# EAGLE design Sensores_2018 (EAGLE 8.5.1)
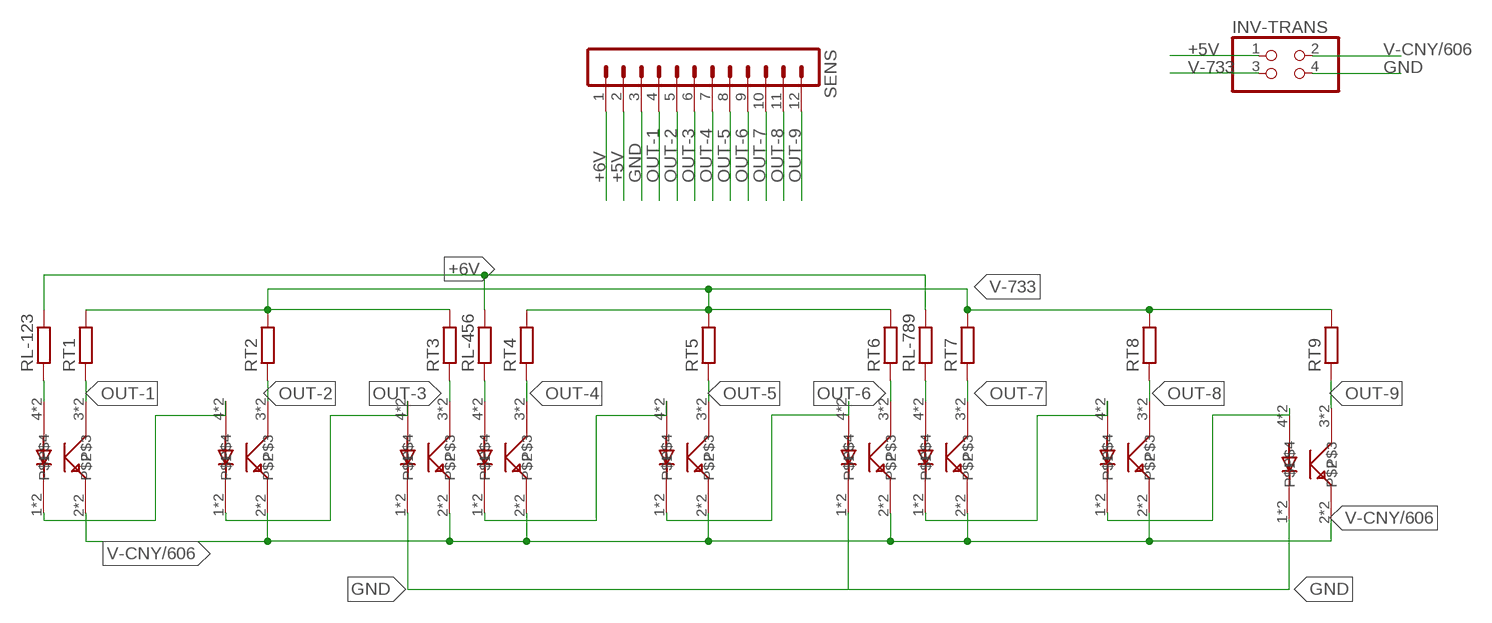
[diagram p0: schematic, sheet 1]

## Parts
INV-TRANS  PINHD-2X2  [2X02]
RL-123  R-EU_R0805W  [R0805W]
RL-456  R-EU_R0805W  [R0805W]
RL-789  R-EU_R0805W  [R0805W]
RT1  R-EU_R0805W  [R0805W]
RT2  R-EU_R0805W  [R0805W]
RT3  R-EU_R0805W  [R0805W]
RT4  R-EU_R0805W  [R0805W]
RT5  R-EU_R0805W  [R0805W]
RT6  R-EU_R0805W  [R0805W]
RT7  R-EU_R0805W  [R0805W]
RT8  R-EU_R0805W  [R0805W]
RT9  R-EU_R0805W  [R0805W]
S1  OPB733+OPB606+CNY70  [OPB733+606]
S2  OPB733+OPB606+CNY70  [OPB733+606]
S3  OPB733+OPB606+CNY70  [OPB733+606]
S4  OPB733+OPB606+CNY70  [OPB733+606]
S5  OPB733+OPB606+CNY70  [OPB733+606]
S6  OPB733+OPB606+CNY70  [OPB733+606]
S7  OPB733+OPB606+CNY70  [OPB733+606]
S8  OPB733+OPB606+CNY70  [OPB733+606]
S9  OPB733+OPB606+CNY70  [OPB733+606]
SENS  MA12-1  [MA12-1]

## Nets
+5V: INV-TRANS.1 SENS.2
+6V: RL-123.2 RL-456.2 RL-789.2 SENS.1
GND: INV-TRANS.4 S3.1 S3.P$1 S6.1 S6.P$1 S9.1 S9.P$1 SENS.3
N$1: RL-123.1 S1.4 S1.P$4
N$2: S1.1 S1.P$1 S2.4 S2.P$4
N$5: S2.1 S2.P$1 S3.4 S3.P$4
N$9: RL-456.1 S4.4 S4.P$4
N$11: S4.1 S4.P$1 S5.4 S5.P$4
N$14: S5.1 S5.P$1 S6.4 S6.P$4
N$18: RL-789.1 S7.4 S7.P$4
N$19: S7.1 S7.P$1 S8.4 S8.P$4
N$22: S8.1 S8.P$1 S9.4 S9.P$4
OUT-1: RT1.1 S1.3 S1.P$3 SENS.4
OUT-2: RT2.1 S2.3 S2.P$3 SENS.5
OUT-3: RT3.1 S3.3 S3.P$3 SENS.6
OUT-4: RT4.1 S4.3 S4.P$3 SENS.7
OUT-5: RT5.1 S5.3 S5.P$3 SENS.8
OUT-6: RT6.1 S6.3 S6.P$3 SENS.9
OUT-7: RT7.1 S7.3 S7.P$3 SENS.10
OUT-8: RT8.1 S8.3 S8.P$3 SENS.11
OUT-9: RT9.1 S9.3 S9.P$3 SENS.12
V-733: INV-TRANS.3 RT1.2 RT2.2 RT3.2 RT4.2 RT5.2 RT6.2 RT7.2 RT8.2 RT9.2
V-CNY/606: INV-TRANS.2 S1.2 S1.P$2 S2.2 S2.P$2 S3.2 S3.P$2 S4.2 S4.P$2 S5.2 S5.P$2 S6.2 S6.P$2 S7.2 S7.P$2 S8.2 S8.P$2 S9.2 S9.P$2

## Library data of the parts
INV-TRANS = pinhead:PINHD-2X2: PIN HEADER
RL-123 RL-456 RL-789 RT1-RT9 = resistor:R-EU_: RESISTOR, European symbol
S1-S9 = photoresistores:OPB733+OPB606+CNY70
SENS = con-lstb:MA12-1: PIN HEADER; OC_FARNELL: unknown; OC_NEWARK: unknown; SPICEPREFIX: X

## Net classes
0 default: width 0.3 mm, drill 0.6 mm, clearance 0.15 mm
1 vcc: width 1.5 mm, drill 0.6 mm, clearance 0.25 mm

## Board
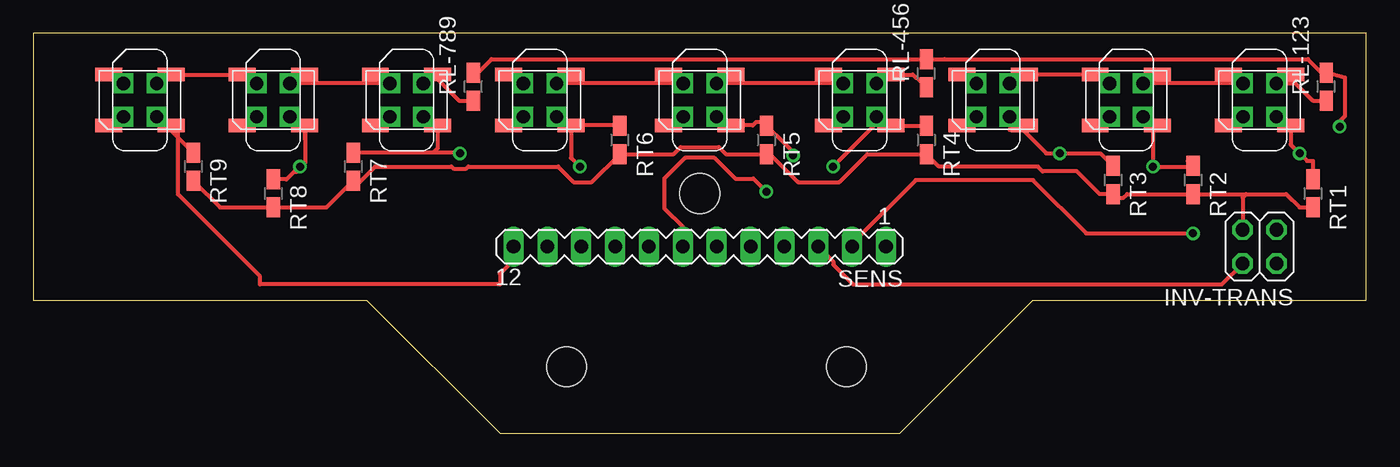
[diagram p1: board, top side]
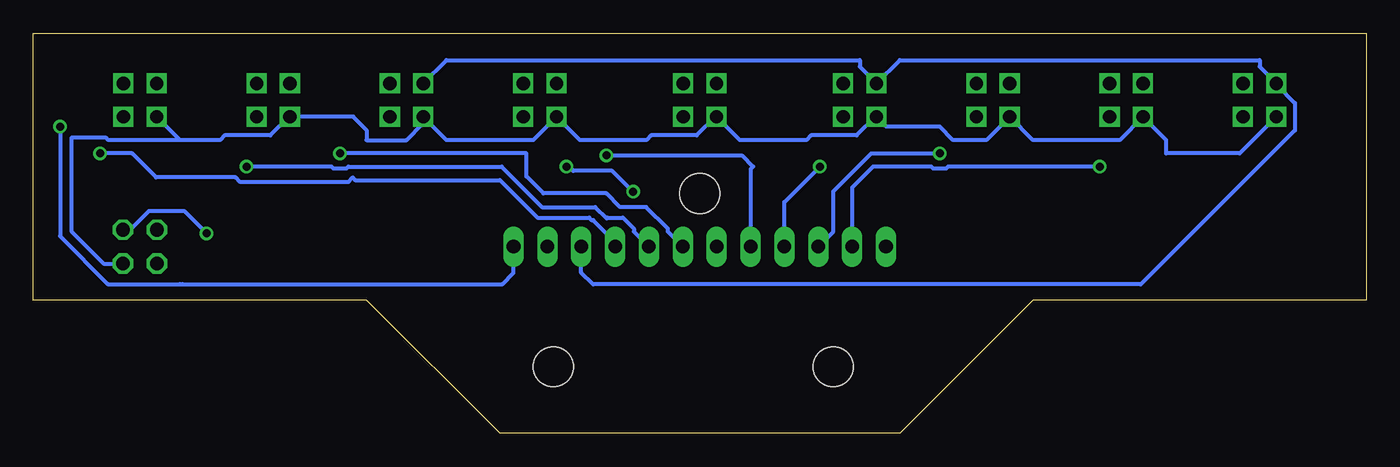
[diagram p2: board, bottom side, seen from below]

Size 100 x 30 mm. Coordinates in mm from the lower left corner, seen from the top.
Outline: 0,10 25,10 35,0 65,0 75,10 100,10 100,30 0,30 0,10
Copper layers (1*16): Top 0.035mm / dielectric 1.5mm / Bottom 0.035mm
Design rules "qre1113gr modulo *": minimum track width 6mil, minimum drill 0.35mm, track to track 0.5mm, track to pad 0.5mm, pad to pad 0.5mm, via to via 0.5mm, smd to smd 6mil, copper to edge 40mil, drill to drill 6mil, minimum pad ring 10mil, minimum via ring 8mil, stop-mask expansion 4mil, vias tented up to drill 0mil, thermal gap 10mil
Holes 3 mm at 61,5 40,5 50,18

### Footprints (pad centres in the part's own frame; a part is rotated, then mirrored left to right if it is on the bottom)
2X02 = drill 1.016 octagon: 1 -1.27,-1.27; 2 -1.27,1.27; 3 1.27,-1.27; 4 1.27,1.27
R0805W = smd 1.5 x 1: 1 -1.052,0; 2 1.052,0
OPB733+606 = smd 1.02 x 2.02: 1 -1.905,-2.34; 2 1.905,-2.34; 3 1.905,2.34; 4 -1.905,2.34 | drill 1 square: P$1 -1.25,-1.25; P$2 1.25,-1.25; P$3 1.25,1.25; P$4 -1.25,1.25
MA12-1 = drill 1.016 long: 1 -13.97,0; 2 -11.43,0; 3 -8.89,0; 4 -6.35,0; 5 -3.81,0; 6 -1.27,0; 7 1.27,0; 8 3.81,0; 9 6.35,0; 10 8.89,0; 11 11.43,0; 12 13.97,0

### Placement (x,y rotation side)
INV-TRANS  92,14 180 top
RL-123  97,26 90 top
RL-456  67,27 90 top
RL-789  33,26 90 top
RT1  96,18 270 top
RT2  87,19 270 top
RT3  81,19 270 top
RT4  67,22 270 top
RT5  55,22 270 top
RT6  44,22 270 top
RT7  24,20 270 top
RT8  18,18 270 top
RT9  12,20 270 top
S1  92,25 270 top
S2  82,25 270 top
S3  72,25 270 top
S4  62,25 270 top
S5  50,25 270 top
S6  38,25 270 top
S7  28,25 270 top
S8  18,25 270 top
S9  8,25 270 top
SENS  50,14 180 top

### Tracks (layer width: path | path; a pad name or v marks a point on that pad's centre or on a via)
+5V  (via drill 0.6)
  Top 0.3: v87,15 79,15 75,19 66.21,19 61.43,14.22 SENS.2
  Bottom 0.3: INV-TRANS.1 92.73,15.27 91.31,16.68 88.68,16.68 v87,15
+6V  (via drill 0.6)
  Top 0.3: RL-789.2 33.37,27.05 34.38,28.07 65.62,28.07 65.63,28.05 RL-456.2 68.37,28.05 68.38,28.07 95.62,28.07 96.63,27.05 RL-123.2 98.4,26.68 98.4,23.8 98,23.4 v98,23
  Bottom 0.3: 89,11.2 94.4,11.2 98,14.8 v98,23 | 89,11.2 88.8,11.2 | 89,11.2 64.8,11.2 63.97,12.03 SENS.1
GND
  Top 0.3: 59.89,13 SENS.3 60.02,12.87 60.02,12.65 61.51,11.17 89.17,11.17 INV-TRANS.4 | S9.1 6,26.8 6.4,26.4 S9.P$1 | S6.P$1 36.4,26.4 36,26.8 S6.1 | S3.1 70,26.8 70.4,26.4 S3.P$1
  Bottom 0.3: S3.P$1 69,28 38,28 38,27.5 S6.P$1 35,28 8,28 8,27.5 S9.P$1 6.75,26.18 5.35,24.77 5.35,22.73 16.91,11.17 58,11.17 58.89,12.06 SENS.3
N$1
  Top 0.3: S1.4 94,26.8 93.6,26.4 S1.P$4 94.7,26.25 96,24.95 RL-123.1
N$2
  Top 0.3: S2.4 84,26.8 83.6,26.4 S2.P$4 S1.P$1 90.4,26.4 90,26.8 S1.1
N$5
  Top 0.3: 74.4,26.91 S2.1 80,26.8 80.4,26.4 S2.P$1 | 74.4,26.91 S3.4 | S3.4 73.91,26.91 S3.P$4 | S3.4 74.4,26.8 74.4,26.91
N$9
  Top 0.3: RL-456.1 66.3,26.65 66.23,26.65 65.98,26.91 S4.4 64,26.8 63.6,26.4 S4.P$4
N$11
  Top 0.3: S5.4 52,26.8 51.6,26.4 S5.P$4 S4.P$1 60.31,26.25 S4.1
N$14
  Top 0.3: S5.1 48,26.8 48.4,26.4 S5.P$1 S6.P$4 39.78,26.78 40.22,26.78 S6.4
N$18
  Top 0.3: S7.P$4 29.6,26.4 30,26.8 S7.4 30.34,26.54 31.94,24.95 RL-789.1
N$19
  Top 0.3: S8.4 20,26.8 19.6,26.4 S8.P$4 S7.P$1 26.4,26.4 26,26.8 S7.1
N$22
  Top 0.3: 15.6,26.91 S9.4 10,26.8 9.6,26.4 S9.P$4 | 15.6,26.91 S8.1 | S8.1 16.09,26.91 S8.P$1 | S8.1 15.6,26.8 15.6,26.91
OUT-1  (via drill 0.6)
  Top 0.3: RT1.1 96,20.44 95.56,20.44 v95,21 94.34,21.66 S1.3 94,23.2 93.6,23.6 S1.P$3
  Bottom 0.3: v95,21 92.6,21 90.8,19.2 84.83,19.2 84.48,18.85 76.39,18.85 76.04,19.2 75.84,19 65,19 62.17,16.17 58.3,16.17 58.13,16 58,16 56.35,14.35 SENS.4
OUT-2  (via drill 0.6)
  Top 0.3: S2.P$3 83.91,23.09 S2.3 84,22.76 v84,20 86.95,20 RT2.1 86.62,20.44
  Bottom 0.3: v84,20 77.63,20 77.48,19.85 76.52,19.85 76.37,20 64.87,20 61.93,17.07 | 61.93,17.07 61.84,16.97 | 61.93,17.07 61.84,16.97 | 61.84,16.97 57.84,16.97 56.99,16.12 56.94,16.17 55.77,16.17 54.94,15.35 54.94,15.13 SENS.5
OUT-3  (via drill 0.6)
  Top 0.3: RT3.1 80.05,21 v77,21 76,21 S3.P$3 | S3.3 74,23.2 73.6,23.6 S3.P$3 | S3.P$3 73.25,22.75
  Bottom 0.3: v77,21 63,21 63,19.26 61.74,18 57,18 55.97,16.97 54.02,16.97 52.4,15.35 52.4,15.13 SENS.6
OUT-4  (via drill 0.6)
  Top 0.3: RT4.1 64.34,23.05 S4.3 64,23.2 63.6,23.6 S4.P$3 63.15,23.75 63.15,23.15 61.6,21.61 v60,20 | SENS.7 48.73,15.5 47.33,16.9 47.33,19.1 48.9,20.67 51.1,20.67 52.67,19.1 54.02,19.1 v55,18.13
  Bottom 0.3: v55,18.13 56.57,19.69 59.48,19.69 59.78,20 v60,20
OUT-5  (via drill 0.6)
  Top 0.3: S5.P$3 51.6,23.6 52,23.2 S5.3 53.98,23.09 54.23,23.35 54.7,23.35 RT5.1 55.7,22.35 55.77,22.35 57,21.12 v57,20.85
  Bottom 0.3: v57,20.85 46.85,20.85 46,20 46.19,19.81 SENS.8
OUT-6  (via drill 0.6)
  Top 0.3: RT6.1 43.96,23.09 S6.3 | S6.3 39.91,23.09 S6.P$3 | v41,20 40.34,20.66 S6.3
  Bottom 0.3: SENS.9 43.65,17.35 v41,20
OUT-7  (via drill 0.6)
  Top 0.3: 30,21.05 30.34,21.39 S7.3 30,23.2 29.6,23.6 S7.P$3 | 30,21.05 32,21.05 31.97,21.03 v32,21 | 30,21.05 RT7.1
  Bottom 0.3: SENS.10 39.98,15.13 39.98,18.15 37.13,21 v32,21
OUT-8  (via drill 0.6)
  Top 0.3: 20.4,22 20.4,23 20,23 S8.P$3 | 20.4,22 20.4,20.3 20.1,20 v20,20 19.6,19.6 | S8.3 20.4,23.2 20.4,22 | 19.75,19.6 19.72,19.63 19.6,19.6 | 19.6,19.6 19.57,19.63 19,19.05 RT8.1
  Bottom 0.3: v20,20 31.37,20 31.52,19.85 32.48,19.85 32.63,20 37,20 38.57,18.43 SENS.11
OUT-9
  Top 0.3: S9.3 10.34,22.71 RT9.1 | S9.3 10.85,22.59 10.85,17.93 17,11.78 17,11.17 35,11.17 35,11.97 36.03,13 | S9.P$3 9.6,23.6 10,23.2 S9.3 | SENS.12 36.03,13 | 36.03,13 36,13
V-733
  Top 0.3: 91,17.95 RT2.2 82.06,17.95 81.77,17.65 81.3,17.65 RT3.2 80,17.95 78.3,19.65 75.72,19.65 75.37,20 67.95,20 RT4.2 62.58,20.95 60.48,18.85 57.37,18.85 55.27,20.95 RT5.2 51.95,20.95 51.44,21.47 48.56,21.47 48.05,20.95 RT6.2 41.9,18.85 40.52,18.85 39.37,20 32.63,20 32.48,19.85 31.52,19.85 31.37,20 25.64,20 24.3,18.65 RT7.2 22,16.95 21,16.95 RT8.2 14,16.95 RT9.2 | 91,17.95 94,17.95 95,16.95 RT1.2 | INV-TRANS.3 90.73,17.68 91,17.95
V-CNY/606
  Top 0.3: S9.2 6,23.2 6.4,23.6 S9.P$2 | S8.P$2 16.4,23.6 16,23.2 S8.2 | S7.2 26,23.2 26.4,23.6 S7.P$2 | S6.2 36,23.2 36.4,23.6 S6.P$2 | S5.2 48,23.2 48.4,23.6 S5.P$2 | S3.2 70,23.2 70.4,23.6 S3.P$2 | S2.2 80,23.2 80.4,23.6 S2.P$2 | S1.2 90,23.2 90.4,23.6 S1.P$2 | S4.2 60.09,23.09 S4.P$2
  Bottom 0.3: S9.P$2 9.5,21 15,21 15,22 S8.P$2 18.5,22 25,22 S7.P$2 28.5,22 31,22 32,23 36,23 S6.P$2 36.82,23.75 38.23,22.35 41.65,22.35 42,22 47,22 S5.P$2 48.82,23.75 50.23,22.35 53.65,22.35 54,22 59,22 S4.P$2 62.5,22 69,22 S3.P$2 70.75,23.25 72,22 75,22 75,22.75 76,23.75 S2.P$2 80.82,23.75 82.23,22.35 85.65,22.35 86,22 89,22 | 89,22 S1.P$2 | 89,22 94.37,22 94.52,22.15 97.15,22.15 97.15,15.16 94.73,12.73 INV-TRANS.2